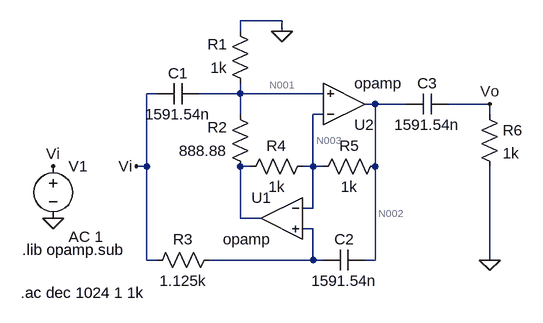
[diagram p0: schematic fhp.asc]
fhp.asc, the LTspice schematic file:
Version 4
SHEET 1 880 680
WIRE 224 -80 160 -80
WIRE 160 -64 160 -80
WIRE 224 -64 224 -80
WIRE 32 32 16 32
WIRE 160 32 160 16
WIRE 160 32 96 32
WIRE 288 32 160 32
WIRE 368 48 352 48
WIRE 416 48 368 48
WIRE 544 48 480 48
WIRE 160 64 160 32
WIRE 288 64 272 64
WIRE 544 64 544 48
WIRE 16 144 16 32
WIRE 16 144 0 144
WIRE 176 144 160 144
WIRE 272 144 272 64
WIRE 272 144 256 144
WIRE 288 144 272 144
WIRE 368 144 368 48
WIRE 272 208 272 144
WIRE 272 208 256 208
WIRE 160 224 160 144
WIRE 192 224 160 224
WIRE 272 240 256 240
WIRE 16 288 16 144
WIRE 32 288 16 288
WIRE 272 288 272 240
WIRE 272 288 112 288
WIRE 288 288 272 288
WIRE 368 288 368 144
WIRE 368 288 352 288
WIRE 544 288 544 144
FLAG 224 -64 0
FLAG 0 144 Vi
FLAG 544 288 0
FLAG 544 48 Vo
FLAG -128 144 Vi
FLAG -128 224 0
SYMBOL OpAmps\\opamp 224 160 M0
SYMATTR InstName U1
SYMBOL OpAmps\\opamp 320 112 M180
SYMATTR InstName U2
SYMBOL res 176 32 R180
WINDOW 0 36 76 Left 2
WINDOW 3 36 40 Left 2
SYMATTR InstName R1
SYMATTR Value 1k
SYMBOL res 176 160 R180
WINDOW 0 36 76 Left 2
WINDOW 3 36 40 Left 2
SYMATTR InstName R2
SYMATTR Value 888.88
SYMBOL res 16 304 R270
WINDOW 0 32 56 VTop 2
WINDOW 3 0 56 VBottom 2
SYMATTR InstName R3
SYMATTR Value 1.125k
SYMBOL res 160 160 R270
WINDOW 0 32 56 VTop 2
WINDOW 3 0 56 VBottom 2
SYMATTR InstName R4
SYMATTR Value 1k
SYMBOL res 272 160 R270
WINDOW 0 32 56 VTop 2
WINDOW 3 0 56 VBottom 2
SYMATTR InstName R5
SYMATTR Value 1k
SYMBOL cap 96 16 R90
WINDOW 0 0 32 VBottom 2
WINDOW 3 32 32 VTop 2
SYMATTR InstName C1
SYMATTR Value 1591.54n
SYMBOL cap 352 272 R90
WINDOW 0 0 32 VBottom 2
WINDOW 3 32 32 VTop 2
SYMATTR InstName C2
SYMATTR Value 1591.54n
SYMBOL cap 480 32 R90
WINDOW 0 0 32 VBottom 2
WINDOW 3 32 32 VTop 2
SYMATTR InstName C3
SYMATTR Value 1591.54n
SYMBOL res 528 48 R0
SYMATTR InstName R6
SYMATTR Value 1k
SYMBOL voltage -128 128 R0
WINDOW 123 24 124 Left 2
WINDOW 39 0 0 Left 0
SYMATTR InstName V1
SYMATTR Value ""
SYMATTR Value2 AC 1
TEXT -176 272 Left 2 !.lib opamp.sub
TEXT -178 338 Left 2 !.ac dec 1024 1 1k

The netlist it stands for:
* fhp.asc
XU1 N003 N005 N004 opamp Aol=100K GBW=10Meg  ; pins invin noninvin out
XU2 N003 N001 N002 opamp Aol=100K GBW=10Meg  ; pins invin noninvin out
R1 N001 0 1k
R2 N004 N001 888.88
R3 Vi N005 1.125k
R4 N004 N003 1k
R5 N003 N002 1k
C1 N001 Vi 1591.54n
C2 N002 N005 1591.54n
C3 Vo N002 1591.54n
R6 Vo 0 1k
V1 Vi 0 AC 1
.lib opamp.sub
.ac dec 1024 1 1k
.backanno
.end

* Results of the author's LTspice run, read from the files saved beside the schematic
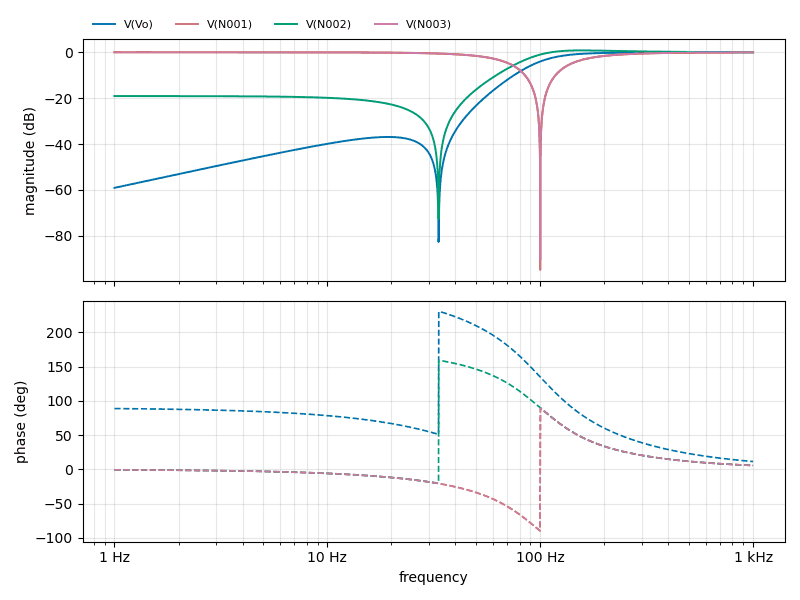
[diagram p1: AC Analysis of fhp.asc, plotted from the saved traces]
* AC Analysis, 1 run:
*   V(Vo): -59.09 dB at 1 Hz, -0.01 dB at 1 kHz, peak -0.01 dB at 1 kHz, 3 dB below the peak at 107.7 Hz
*   V(N001): -0.00 dB at 1 Hz, -0.04 dB at 1 kHz, peak -0.00 dB at 1 Hz, 3 dB below the peak at 61.81 Hz
*   V(N002): -19.09 dB at 1 Hz, 0.03 dB at 1 kHz, peak 0.80 dB at 155.7 Hz, 3 dB below the peak at 91.07 Hz
*   V(N003): -0.00 dB at 1 Hz, -0.04 dB at 1 kHz, peak -0.00 dB at 1 Hz, 3 dB below the peak at 61.81 Hz